# EAGLE design E18 Simple Breakout (EAGLE 9.6.2)
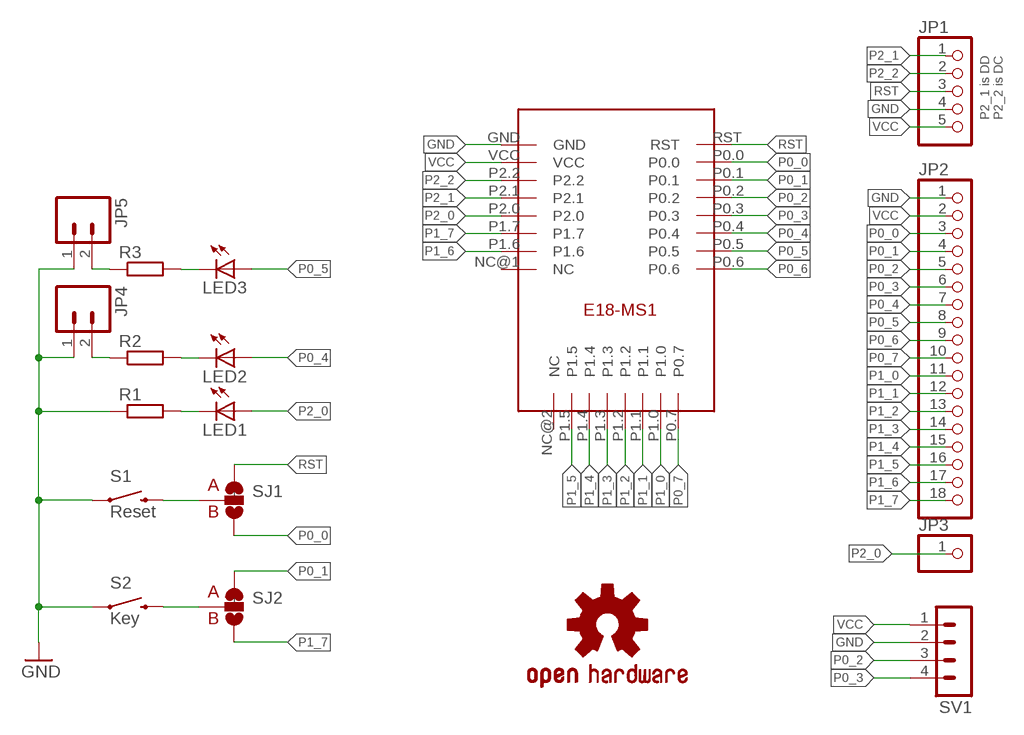
[diagram p0: schematic, sheet 1]

## Parts
JP1  PINHD-1X5  [1X05]
JP2  PINHD-1X18  [1X18]
JP3  PINHD-1X1  [1X01]
JP4  HEADER-1X2P1X02_NO_SILK  [1X02_NO_SILK]
JP5  HEADER-1X2P1X02_NO_SILK  [1X02_NO_SILK]
LED1  LED1206  [LED-1206]
LED2  LED1206  [LED-1206]
LED3  LED1206  [LED-1206]
LOGO1  OSHW-LOGOM  [OSHW-LOGO-M]
R1  R-EU_  [1206]
R2  R-EU_  [1206]
R3  R-EU_  [1206]
S1  Reset  SWITCH-MOMENTARY-2PTH  [TACTILE-PTH]
S2  Key  SWITCH-MOMENTARY-2PTH  [TACTILE-PTH]
SJ1  SOLDERJUMPER_2WAYT  [SJ_2]
SJ2  SOLDERJUMPER_2WAYT  [SJ_2]
SV1  HEADER-1X4P  [MA04-1]
U$1  E18-MS1PCB  [E18-MS1-PCB]

## Nets
GND: JP1.4 JP2.1 JP4.1 JP5.1 R1.1 S1.1 S2.1 SV1.2 U$1.GND
N$1: LED3.C R3.2
N$2: S1.3 SJ1.2
N$3: JP4.2 R2.1
N$4: JP5.2 R3.1
N$5: S2.3 SJ2.2
N$6: LED2.C R2.2
N$7: LED1.C R1.2
P0_0: JP2.3 SJ1.3 U$1.P0.0
P0_1: JP2.4 SJ2.1 U$1.P0.1
P0_2: JP2.5 SV1.3 U$1.P0.2
P0_3: JP2.6 SV1.4 U$1.P0.3
P0_4: JP2.7 LED2.A U$1.P0.4
P0_5: JP2.8 LED3.A U$1.P0.5
P0_6: JP2.9 U$1.P0.6
P0_7: JP2.10 U$1.P0.7
P1_0: JP2.11 U$1.P1.0
P1_1: JP2.12 U$1.P1.1
P1_2: JP2.13 U$1.P1.2
P1_3: JP2.14 U$1.P1.3
P1_4: JP2.15 U$1.P1.4
P1_5: JP2.16 U$1.P1.5
P1_6: JP2.17 U$1.P1.6
P1_7: JP2.18 SJ2.3 U$1.P1.7
P2_0: JP3.1 LED1.A U$1.P2.0
P2_1: JP1.1 U$1.P2.1
P2_2: JP1.2 U$1.P2.2
RST: JP1.3 SJ1.1 U$1.RST
VCC: JP1.5 JP2.2 SV1.1 U$1.VCC
Unconnected: U$1.NC@1(NC) U$1.NC@2(NC)

## Notes on the sheet
- P2_1 is DD
  P2_2 is DC

## Library data of the parts
JP1 = pinhead:PINHD-1X5: PIN HEADER
JP2 = pinhead:PINHD-1X18: PIN HEADER
JP3 = pinhead:PINHD-1X1: PIN HEADER
JP4 JP5 = Master 2016:HEADER-1X2P: Header 2 Standard 2-pin 0.1" header. Use with straight break away headers (SKU : PRT-00116), right angle break away headers (PRT-00553), swiss pins (PRT-00743), machine pins (PRT-00117), and female headers (PRT-00115). Molex polarized connector foot print use with SKU : PRT-08233 with associated crimp pins and housings.
LED1-LED3 = Master 2016:LED: LEDs Standard schematic elements and footprints for 5mm, 3mm, 1206, and 0603 sized LEDs. 5mm - Spark Fun Electronics SKU : COM-00529 (and others)
LOGO1 = Master 2016:OSHW-LOGO: Open Source Hardware Logo This logo indicates the piece of hardware it is found on incorporates a OSHW license and/or adheres to the definition of open source hardware found here: http://freedomdefined.org/OSHW
R1-R3 = Master 2016:R-EU_: RESISTOR, European symbol
S1 S2 = Master 2016:SWITCH-MOMENTARY-2: Various NO switches- pushbuttons, reed, etc
SJ1 SJ2 = Master 2016:SOLDERJUMPER_2WAY: Solder Jumper 2 way solder jumper
SV1 = Master 2016:HEADER-1X4P: PIN HEADER; OC_FARNELL: unknown; OC_NEWARK: unknown
U$1 = SMD Stamp Modules:E18-MS1

## Board
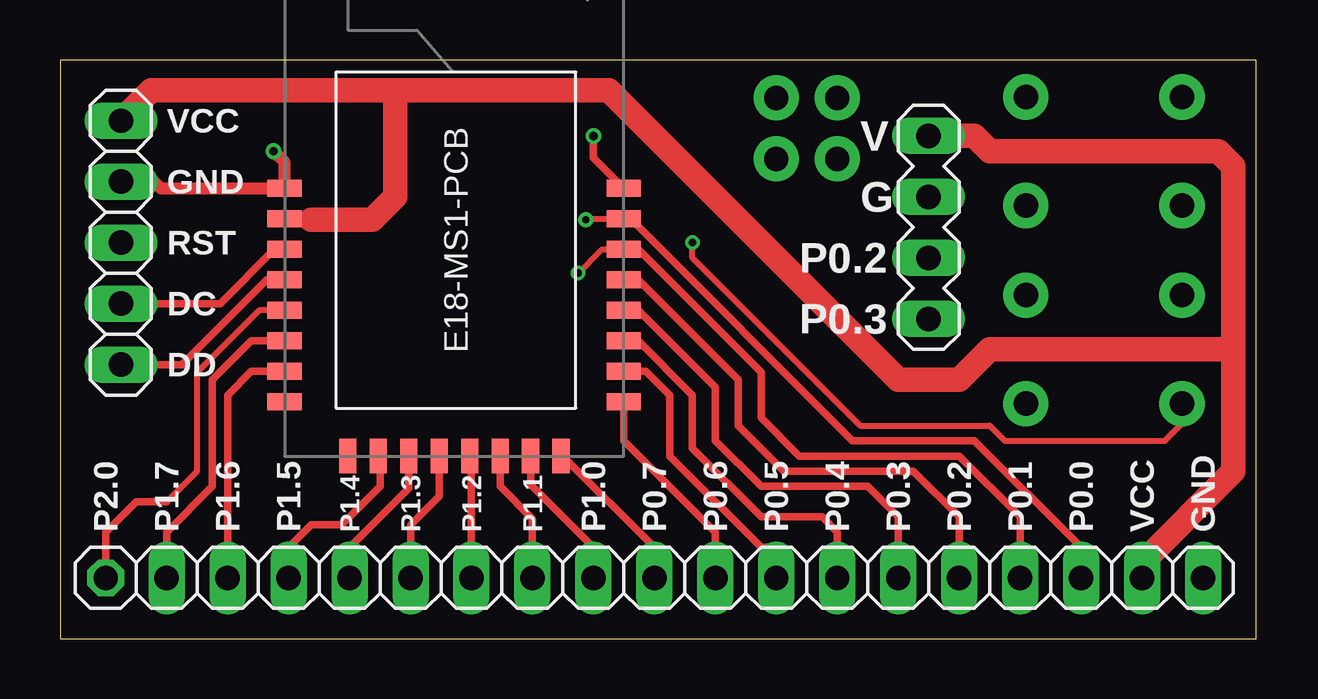
[diagram p1: board, top side]
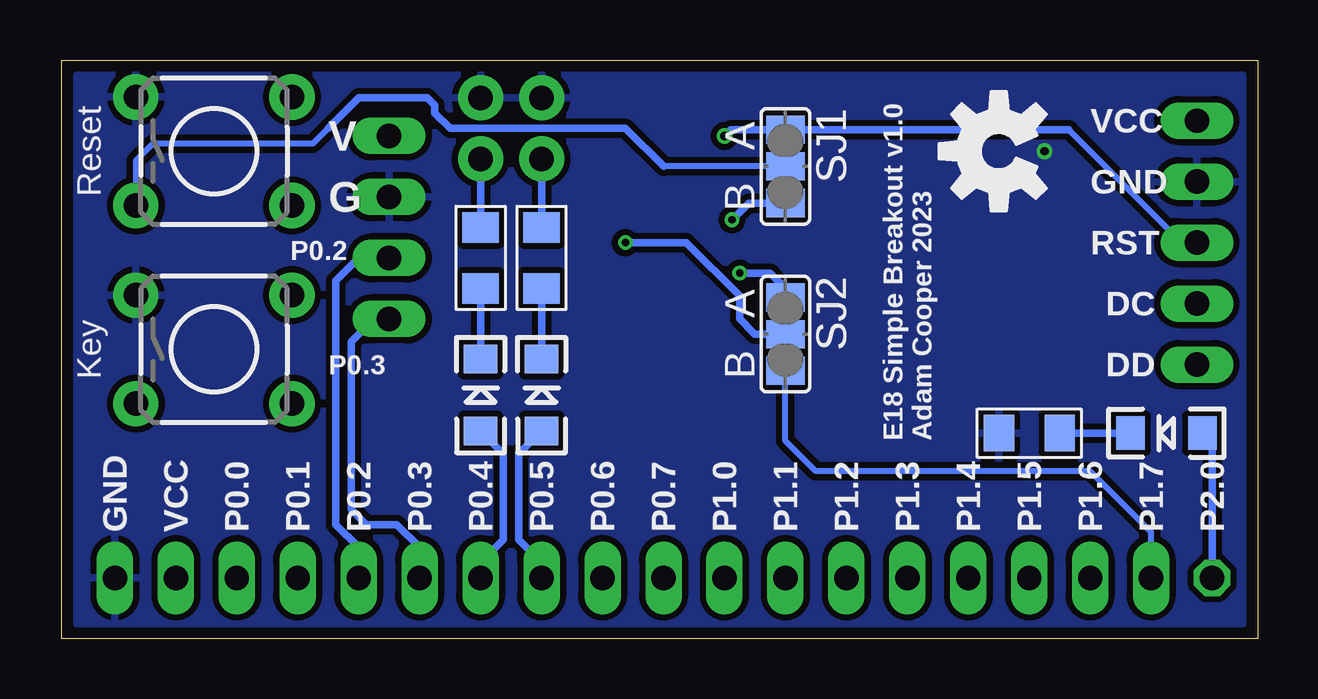
[diagram p2: board, bottom side, seen from below]

Size 49.84 x 24.12 mm. Coordinates in mm from the lower left corner, seen from the top.
Outline: 0,0 49.84,0 49.84,24.12 0,24.12 0,0
Copper layers (1*16): Top 0.035mm / dielectric 1.5mm / Bottom 0.035mm
Design rules "Seeed Fusion_eagle_rule_v1.1": minimum track width 6mil, minimum drill 12mil, track to track 6mil, track to pad 6mil, pad to pad 6mil, via to via 6mil, smd to smd 0mil, copper to edge 10mil, drill to drill 10mil, minimum pad ring 10mil, minimum via ring 6mil, stop-mask expansion 2mil, vias tented up to drill 100mil, thermal gap 10mil

### Footprints (pad centres in the part's own frame; a part is rotated, then mirrored left to right if it is on the bottom)
1X05 = drill 1.016 long: 1 -5.08,0; 2 -2.54,0; 3 0,0; 4 2.54,0; 5 5.08,0
1X18 = drill 1.016 long: 1 -21.59,0; 2 -19.05,0; 3 -16.51,0; 4 -13.97,0; 5 -11.43,0; 6 -8.89,0; 7 -6.35,0; 8 -3.81,0; 9 -1.27,0; 10 1.27,0; 11 3.81,0; 12 6.35,0; 13 8.89,0; 14 11.43,0; 15 13.97,0; 16 16.51,0; 17 19.05,0; 18 21.59,0
1X01 = drill 1.016 octagon: 1 0,0
1X02_NO_SILK = drill 1.016 pad 1.88: 1 0,0; 2 2.54,0
LED-1206 = smd 1.2 x 1.4: A -1.5,0; C 1.5,0
1206 = smd 1.27 x 1.524: 1 -1.27,0; 2 1.27,0
TACTILE-PTH = drill 1.016 pad 1.88: 1 -3.251,2.261; 2 3.251,2.261; 3 -3.251,-2.261; 4 3.251,-2.261
SJ_2 = smd 1.168 x 1.6: 1 -1.524,0; 2 0,0; 3 1.524,0
MA04-1 = drill 1.016 long: 1 -3.81,0; 2 -1.27,0; 3 1.27,0; 4 3.81,0
E18-MS1-PCB = smd 0.711 x 1.422: GND 11.15,14.14; NC@1 2.26,14.14; P0.0 9.88,0; P0.1 8.61,0; P0.2 7.34,0; P0.3 6.07,0; P0.4 4.8,0; P0.5 3.53,0; P0.6 2.26,0; P1.6 3.53,14.14; P1.7 4.8,14.14; P2.0 6.07,14.14; P2.1 7.34,14.14; P2.2 8.61,14.14; RST 11.15,0; VCC 9.88,14.14 | smd 1.422 x 0.711: NC@2 0,11.51; P0.7 0,2.62; P1.0 0,3.89; P1.1 0,5.16; P1.2 0,6.43; P1.3 0,7.7; P1.4 0,8.97; P1.5 0,10.24

### Placement (x,y rotation side)
JP1  2.54,16.51 90 top
JP2  26.04,2.54 180 top
JP3  1.91,2.54 0 top
JP4  32.38,22.54 270 top
JP5  29.84,22.54 270 top
LED1  3.81,8.57 180 bottom
LED2  32.38,10.16 90 bottom
LED3  29.84,10.16 90 bottom
LOGO1  10.79,20.32 90 bottom
R1  9.53,8.57 0 bottom
R2  32.38,15.88 270 bottom
R3  29.84,15.88 270 bottom
S1  43.5,20.32 0 bottom
S2  43.5,12.06 0 bottom
SJ1  19.68,19.68 270 bottom
SJ2  19.68,12.7 270 bottom
SV1  36.2,17.14 270 top
U$1  23.5,7.62 90 top

### Tracks (layer width: path | path; a pad name or v marks a point on that pad's centre or on a via)
GND  (via drill 0.35 pad 0.61)
  Top 0.508: v8.89,20.32 9.36,19.86 U$1.GND 4.2,18.77 3.92,19.05 JP1.4
  pour Bottom (isolate 0.254): 0.64,23.5 0.64,0.64 49.21,0.64 49.21,23.5
N$1
  Bottom 0.305: R3.2 LED3.C
N$2
  Bottom 0.254: 38.73,21.27 39.37,20.64 46.04,20.64 46.75,19.93 S1.3 | SJ1.2 24.77,19.68
  Bottom 0.305: 24.77,19.68 26.35,21.27 33.66,21.27 34.29,21.91 34.29,22.23 34.61,22.54 37.47,22.54 38.73,21.27
N$3
  Bottom 0.305: R2.1 JP4.2
N$4
  Bottom 0.305: R3.1 JP5.2
N$5  (via drill 0.3 pad 0.61)
  Top 0.254: S2.3 46.75,8.97 46.04,8.26 39.37,8.26 38.73,8.89 33.34,8.89 26.35,15.88 v26.35,16.51
  Bottom 0.305: SJ2.2 20.95,12.7 21.59,13.34 21.59,14.29 23.81,16.51 v26.35,16.51
N$6
  Bottom 0.305: R2.2 LED2.C
N$7
  Bottom 0.305: LED1.C R1.2
P0_0  (via drill 0.3 pad 0.61)
  Top 0.254: v21.91,17.46 21.95,17.5 23.81,17.5
  Top 0.305: U$1.P0.0 23.81,17.5 23.81,17.46 33.02,8.26 38.1,8.26 42.55,3.81 JP2.3
  Bottom 0.305: v21.91,17.46 21.21,18.16 SJ1.3
P0_1  (via drill 0.3 pad 0.61)
  Top 0.254: v21.59,15.24 22.58,16.23 U$1.P0.1
  Top 0.305: U$1.P0.1 24.09,16.23 29.21,11.11 29.21,9.21 30.8,7.62 37.47,7.62 40.01,5.08 JP2.4
  Bottom 0.254: SJ2.1 19.68,14.61
  Bottom 0.305: 19.68,14.61 20.32,15.24 v21.59,15.24
P0_2
  Top 0.305: U$1.P0.2 24.09,14.96 28.26,10.79 28.26,8.89 30.16,6.99 35.56,6.99 37.47,5.08 JP2.5
  Bottom 0.305: SV1.3 37.47,15.88 38.42,14.92 38.42,4.76 37.47,3.81 JP2.5
P0_3
  Top 0.305: U$1.P0.3 24.09,13.69 27.3,10.48 27.3,8.26 29.21,6.35 33.66,6.35 34.92,5.08 JP2.6
  Bottom 0.305: SV1.4 36.83,13.34 37.78,12.38 37.78,5.4 37.15,4.76 35.88,4.76 34.92,3.81 JP2.6
P0_4
  Top 0.305: U$1.P0.4 24.09,12.42 26.35,10.16 26.35,7.94 29.21,5.08 31.75,5.08 32.38,4.45 JP2.7
  Bottom 0.305: LED2.A 31.43,7.71 31.43,4.13 32.38,3.17 JP2.7
P0_5
  Top 0.305: U$1.P0.5 24.41,11.15 25.4,10.16 25.4,7.62 29.21,3.81 29.84,3.81 JP2.8
  Bottom 0.305: LED3.A 30.8,7.71 30.8,4.13 29.84,3.17 JP2.8
P0_6
  Top 0.305: U$1.P0.6 23.5,8.26 27.3,4.45 JP2.9
P0_7
  Top 0.305: U$1.P0.7 20.95,7.62 24.77,3.81 JP2.10
P1_0
  Top 0.305: JP2.11 22.23,3.81 19.61,6.43 U$1.P1.0
P1_1
  Top 0.305: U$1.P1.1 18.34,6.35 19.68,5 JP2.12
P1_2
  Top 0.305: U$1.P1.2 17.14,7.54 JP2.13
P1_3
  Top 0.305: U$1.P1.3 15.79,5.95 14.61,4.76 JP2.14
P1_4
  Top 0.305: U$1.P1.4 14.53,6.27 12.06,3.81 JP2.15
P1_5
  Top 0.305: U$1.P1.5 13.34,7.54 13.34,6.35 11.75,4.76 10.48,4.76 9.53,3.81 JP2.16
P1_6
  Top 0.305: JP2.17 6.99,10.16 7.97,11.15 U$1.P1.6
P1_7
  Top 0.305: U$1.P1.7 7.97,12.42 6.35,10.79 6.35,6.35 4.45,4.45 JP2.18
  Bottom 0.254: JP2.18 4.45,4.45 6.99,6.99 18.41,6.99 19.68,8.26 SJ2.3
P2_0
  Top 0.254: 4.45,5.71 5.71,6.99 5.71,11.11 8.29,13.69 U$1.P2.0
  Top 0.305: JP3.1 1.91,4.45 3.17,5.71 4.45,5.71
  Bottom 0.305: JP3.1 1.91,8.17 LED1.A
P2_1
  Top 0.305: JP1.1 5.08,11.43 8.61,14.96 U$1.P2.1
P2_2
  Top 0.305: JP1.2 6.67,13.97 8.93,16.23 U$1.P2.2
RST  (via drill 0.35 pad 0.61)
  Top 0.305: v22.23,20.95 22.23,20.04 U$1.RST
  Bottom 0.254: JP1.3 3.17,16.51 7.87,21.21
  Bottom 0.305: v22.23,20.95 21.97,21.21 SJ1.1 7.87,21.21
VCC
  Top 0.305: 45.09,3.17 JP2.2
  Top 0.61: U$1.VCC 10.44,17.5 10.48,17.46
  Top 1.016: JP1.5 3.81,22.86 13.97,22.86 | 45.09,3.17 48.9,6.99 48.9,12.06 | 13.97,22.86 13.97,18.41 13.02,17.46 10.48,17.46 | 13.97,22.86 22.86,22.86 34.92,10.79 37.47,10.79 38.73,12.06 48.9,12.06 | SV1.1 38.1,20.95 38.73,20.32 48.26,20.32 48.9,19.68 48.9,12.06

### Text on the board
tPlace: VCC | V | GND | G | RST | P0.2 | DC | P0.3 | DD | P2.0 | P1.7 | P1.6 | P1.5 | P1.4 | P1.3 | P1.2 | P1.1 | P1.0 | P0.7 | P0.6 | P0.5 | P0.4 | P0.3 | P0.2 | P0.1 | P0.0 | VCC | GND
bPlace: VCC | V | GND | G | RST | P0.2 | DC | DD | P0.3 | E18 Simple Breakout v1.0 / Adam Cooper 2023 | P2.0 | P1.7 | P1.6 | P1.5 | P1.4 | P1.3 | P1.2 | P1.1 | P1.0 | P0.7 | P0.6 | P0.5 | P0.4 | P0.3 | P0.2 | P0.1 | P0.0 | VCC | GND
_bPlace: SJ1 | SJ2
_bNames: SJ1 | SJ2